# EAGLE design wheel-opto-sensor-v2 (EAGLE 8.2.1)
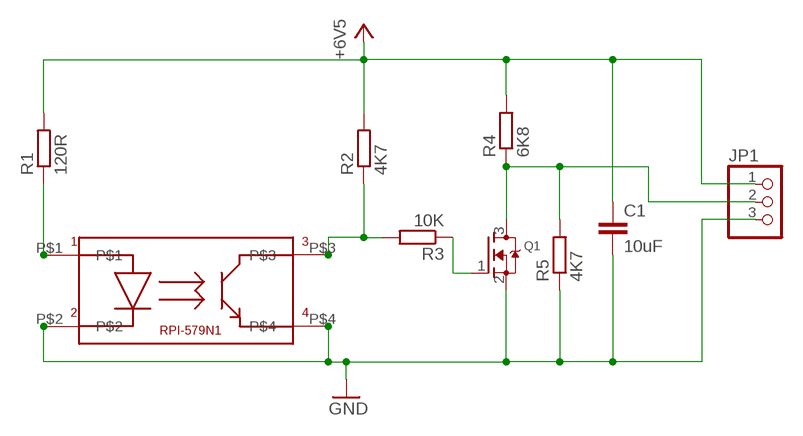
[diagram p0: schematic, sheet 1]

## Parts
C1  10uF  C-EUC1206  [C1206]
JP1  PINHD-1X3  [1X03]
Q1  MOSFET-NREFLOW  [SOT23]
R1  120R  R-EU_M0805  [M0805]
R2  4K7  R-EU_M0805  [M0805]
R3  10K  R-EU_M0805  [M0805]
R4  6K8  R-EU_M0805  [M0805]
R5  4K7  R-EU_M0805  [M0805]
U$1  RPI-579N1  [RPI-579N1]

## Nets
+6V5: C1.1 JP1.1 R1.2 R2.2 R4.2
GND: C1.2 JP1.3 Q1.2(S) R5.1 U$1.P$2 U$1.P$4
N$1: JP1.2 Q1.3(D) R4.1 R5.2
N$2: R1.1 U$1.P$1
N$3: Q1.1(G) R3.1
N$5: R2.1 R3.2 U$1.P$3

## Library data of the parts
C1 = rcl:C-EU: CAPACITOR, European symbol
JP1 = pinhead:PINHD-1X3: PIN HEADER
Q1 = adafruit:MOSFET-N: N-Channel Mosfet 2N7002E - 60V 260mA SOT23 [Digikey: 2N7002ET1GOSTR-ND] - REEL BSH103 - 30V 850mA SOT23 [Digikey: 568-5013-1-ND]
R1-R5 = rcl:R-EU_: RESISTOR, European symbol
U$1 = reprapltd:RPI-579N1

## Board
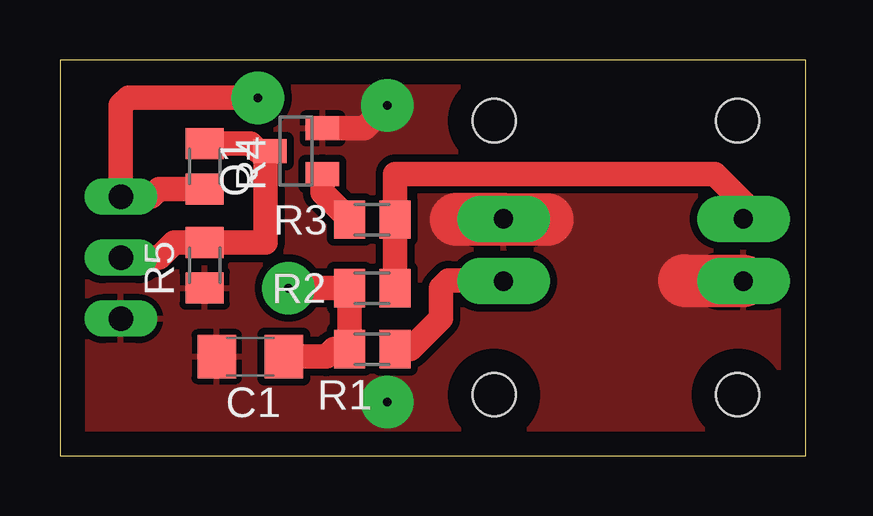
[diagram p1: board, top side]
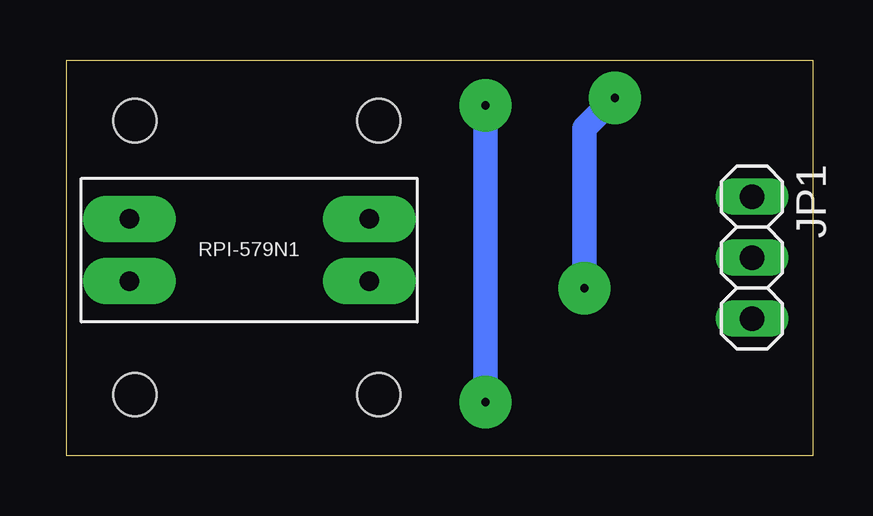
[diagram p2: board, bottom side, seen from below]

Size 31.1 x 16.5 mm. Coordinates in mm from the lower left corner, seen from the top.
Outline: 0,0 31.1,0 31.1,16.5 0,16.5 0,0
Copper layers (1*16): Top 0.035mm / dielectric 1.5mm / Bottom 0.035mm
Design rules "default *": minimum track width 10mil, minimum drill 24mil, track to track 12mil, track to pad 12mil, pad to pad 12mil, via to via 12mil, smd to smd 8mil, copper to edge 40mil, drill to drill 8mil, minimum pad ring 10mil, minimum via ring 8mil, stop-mask expansion 4mil, vias tented up to drill 0mil, thermal gap 10mil
Holes 1.8 mm at 18.1,2.54 18.1,13.97 28.26,13.97 28.26,2.54

### Footprints (pad centres in the part's own frame; a part is rotated, then mirrored left to right if it is on the bottom)
C1206 = smd 1.6 x 1.8: 1 -1.4,0; 2 1.4,0
1X03 = drill 1.016 long: 1 -2.54,0; 2 0,0; 3 2.54,0
SOT23 = smd 1 x 1.4: 1 -0.95,-1.1; 2 0.95,-1.1; 3 0,1.1
M0805 = smd 1.3 x 1.6: 1 -0.95,0; 2 0.95,0
RPI-579N1 = drill 0.8 pad 1.93 long: P$1 -5,1.3; P$2 -5,-1.3; P$3 5,-1.3; P$4 5,1.3

### Placement (x,y rotation side)
C1  7.94,4.13 180 top
JP1  2.54,8.26 270 bottom
Q1  9.84,12.7 90 top
R1  13.02,4.45 180 top
R2  13.02,6.99 180 top
R3  13.02,9.84 0 top
R4  6.03,12.06 270 top
R5  6.03,7.94 90 top
U$1  23.5,8.57 180 bottom

### Tracks (layer width: path | path; a pad name or v marks a point on that pad's centre or on a via)
+6V5  (via drill 0.35 pad 2.18)
  Top 1.016: R4.2 4.13,11.11 3.81,10.79 JP1.1 2.54,14.61 2.86,14.92 v8.26,14.92 | C1.1 11.11,4.13 11.43,4.45 R1.2 R2.2 v9.53,6.99
  Bottom 1.016: v9.53,6.99 9.53,13.65 v8.26,14.92
GND  (via drill 0.35 pad 2.18)
  Top 1.016: Q1.2 12.7,13.65 v13.65,14.61
  Top 2.184: U$1.P$2 16.54,9.87 16.51,9.84 20.32,9.84 | U$1.P$4 26.07,7.27 26.04,7.3
  Bottom 1.016: v13.65,14.61 v13.65,2.22 13.65,2.16
  pour Top: 0,0 0,16.51 31.11,16.51 31.11,0
N$1
  Top 1.016: JP1.2 4.13,8.26 4.76,8.89 R5.2 8.57,8.89 8.57,12.53 Q1.3 8.26,12.7 7.94,13.02 R4.1
N$2
  Top 1.016: R1.1 14.61,4.45 15.88,5.71 15.88,6.99 16.19,7.3 18.46,7.3 U$1.P$1
N$3
  Top 1.016: Q1.1 10.94,10.97 R3.1
N$5
  Top 1.016: R2.1 R3.2 13.97,11.75 27.3,11.75 28.57,10.48 28.57,9.95 U$1.P$3